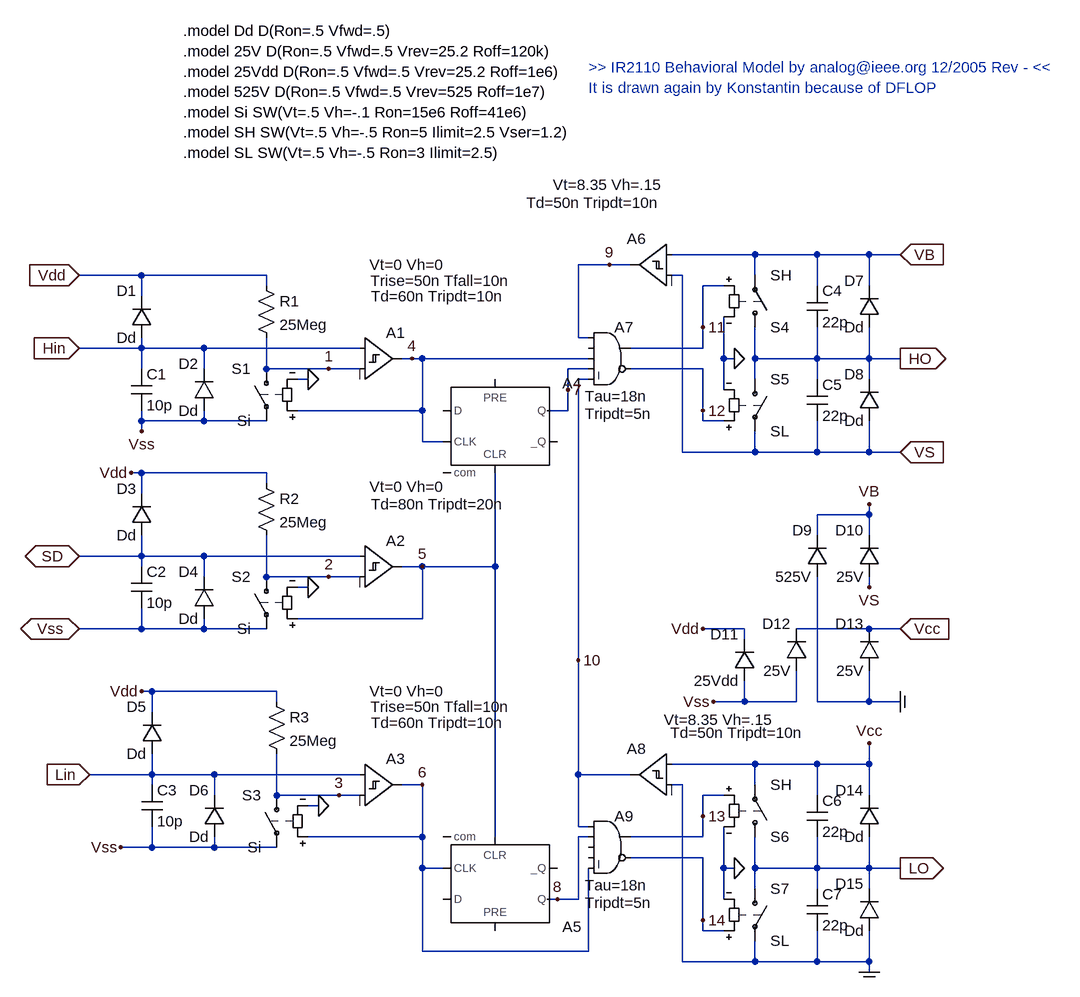
[diagram p0: schematic IR2110A.asc]
IR2110A.asc, the LTspice schematic file:
Version 4
SHEET 1 3528 1264
WIRE 1696 -336 1568 -336
WIRE 1792 -336 1696 -336
WIRE 1872 -336 1792 -336
WIRE 1920 -336 1872 -336
WIRE 1472 -320 1424 -320
WIRE 1504 -320 1472 -320
WIRE 752 -304 656 -304
WIRE 944 -304 752 -304
WIRE 1584 -304 1568 -304
WIRE 1696 -304 1696 -336
WIRE 944 -288 944 -304
WIRE 1648 -288 1616 -288
WIRE 1792 -288 1792 -336
WIRE 1872 -288 1872 -336
WIRE 752 -272 752 -304
WIRE 1616 -224 1616 -288
WIRE 1424 -208 1424 -320
WIRE 1440 -208 1424 -208
WIRE 752 -192 752 -208
WIRE 752 -192 656 -192
WIRE 848 -192 752 -192
WIRE 1088 -192 848 -192
WIRE 1616 -192 1616 -224
WIRE 1616 -192 1504 -192
WIRE 1168 -176 1152 -176
WIRE 1184 -176 1168 -176
WIRE 1440 -176 1184 -176
WIRE 1648 -176 1648 -240
WIRE 1664 -176 1648 -176
WIRE 1696 -176 1696 -224
WIRE 1792 -176 1792 -224
WIRE 1792 -176 1696 -176
WIRE 1872 -176 1872 -224
WIRE 1872 -176 1792 -176
WIRE 1920 -176 1872 -176
WIRE 752 -160 752 -192
WIRE 848 -160 848 -192
WIRE 944 -160 944 -208
WIRE 1040 -160 944 -160
WIRE 1088 -160 1040 -160
WIRE 1440 -160 1408 -160
WIRE 1616 -160 1504 -160
WIRE 1008 -144 992 -144
WIRE 1440 -144 1424 -144
WIRE 1696 -144 1696 -176
WIRE 1792 -144 1792 -176
WIRE 1872 -144 1872 -176
WIRE 1408 -128 1408 -160
WIRE 1648 -128 1648 -176
WIRE 1184 -96 1184 -176
WIRE 1184 -96 992 -96
WIRE 1408 -96 1408 -128
WIRE 1408 -96 1376 -96
WIRE 1616 -96 1616 -160
WIRE 752 -80 752 -96
WIRE 848 -80 848 -96
WIRE 848 -80 752 -80
WIRE 944 -80 848 -80
WIRE 1616 -80 1616 -96
WIRE 1648 -80 1616 -80
WIRE 752 -64 752 -80
WIRE 1184 -48 1184 -96
WIRE 1216 -48 1184 -48
WIRE 1584 -32 1584 -304
WIRE 1696 -32 1696 -64
WIRE 1696 -32 1584 -32
WIRE 1792 -32 1792 -80
WIRE 1792 -32 1696 -32
WIRE 1872 -32 1872 -80
WIRE 1872 -32 1792 -32
WIRE 1920 -32 1872 -32
WIRE 752 0 736 0
WIRE 944 0 752 0
WIRE 944 16 944 0
WIRE 752 32 752 0
WIRE 1872 64 1872 48
WIRE 1872 64 1792 64
WIRE 1792 96 1792 64
WIRE 1872 96 1872 64
WIRE 752 128 752 96
WIRE 752 128 656 128
WIRE 848 128 752 128
WIRE 1088 128 848 128
WIRE 752 144 752 128
WIRE 1184 144 1152 144
WIRE 1296 144 1296 0
WIRE 1296 144 1184 144
WIRE 848 160 848 128
WIRE 944 160 944 96
WIRE 1040 160 944 160
WIRE 1088 160 1040 160
WIRE 1008 176 992 176
WIRE 1872 176 1872 160
WIRE 1184 224 1184 144
WIRE 1184 224 992 224
WIRE 752 240 752 208
WIRE 752 240 656 240
WIRE 848 240 848 224
WIRE 848 240 752 240
WIRE 944 240 848 240
WIRE 1680 240 1616 240
WIRE 1872 240 1760 240
WIRE 1920 240 1872 240
WIRE 1680 256 1680 240
WIRE 1424 288 1424 -144
WIRE 768 336 752 336
WIRE 960 336 768 336
WIRE 960 352 960 336
WIRE 1680 352 1680 320
WIRE 1680 352 1632 352
WIRE 1760 352 1760 304
WIRE 1760 352 1680 352
WIRE 1792 352 1792 160
WIRE 1872 352 1872 304
WIRE 1872 352 1792 352
WIRE 1920 352 1872 352
WIRE 768 368 768 336
WIRE 1696 448 1568 448
WIRE 1792 448 1696 448
WIRE 1872 448 1872 416
WIRE 1872 448 1792 448
WIRE 768 464 768 432
WIRE 768 464 672 464
WIRE 864 464 768 464
WIRE 1088 464 864 464
WIRE 1424 464 1424 288
WIRE 1504 464 1424 464
WIRE 768 480 768 464
WIRE 1184 480 1152 480
WIRE 1584 480 1568 480
WIRE 1696 480 1696 448
WIRE 864 496 864 464
WIRE 960 496 960 432
WIRE 1056 496 960 496
WIRE 1088 496 1056 496
WIRE 1648 496 1616 496
WIRE 1792 496 1792 448
WIRE 1872 496 1872 448
WIRE 1024 512 1008 512
WIRE 1616 528 1616 496
WIRE 1424 544 1424 464
WIRE 1440 544 1424 544
WIRE 1184 560 1184 480
WIRE 1184 560 1008 560
WIRE 1296 560 1296 144
WIRE 1440 560 1424 560
WIRE 1616 560 1616 528
WIRE 1616 560 1504 560
WIRE 768 576 768 544
WIRE 768 576 720 576
WIRE 864 576 864 560
WIRE 864 576 768 576
WIRE 960 576 864 576
WIRE 1616 592 1504 592
WIRE 1184 608 1184 560
WIRE 1216 608 1184 608
WIRE 1648 608 1648 544
WIRE 1664 608 1648 608
WIRE 1696 608 1696 560
WIRE 1792 608 1792 560
WIRE 1792 608 1696 608
WIRE 1872 608 1872 560
WIRE 1872 608 1792 608
WIRE 1920 608 1872 608
WIRE 1696 640 1696 608
WIRE 1792 640 1792 608
WIRE 1872 640 1872 608
WIRE 1392 656 1376 656
WIRE 1424 656 1424 560
WIRE 1424 656 1392 656
WIRE 1648 656 1648 608
WIRE 1616 688 1616 592
WIRE 1616 704 1616 688
WIRE 1648 704 1616 704
WIRE 1184 736 1184 608
WIRE 1440 736 1440 608
WIRE 1440 736 1184 736
WIRE 1584 752 1584 480
WIRE 1696 752 1696 720
WIRE 1696 752 1584 752
WIRE 1792 752 1792 704
WIRE 1792 752 1696 752
WIRE 1872 752 1872 704
WIRE 1872 752 1792 752
WIRE 1872 768 1872 752
FLAG 656 -192 Hin
IOPIN 656 -192 In
FLAG 752 -64 Vss
FLAG 656 -304 Vdd
IOPIN 656 -304 In
FLAG 1008 -144 0
FLAG 1040 -160 1
FLAG 1168 -176 4
FLAG 656 128 SD
IOPIN 656 128 BiDir
FLAG 656 240 Vss
IOPIN 656 240 BiDir
FLAG 736 0 Vdd
FLAG 1008 176 0
FLAG 1040 160 2
FLAG 1184 144 5
FLAG 672 464 Lin
IOPIN 672 464 In
FLAG 720 576 Vss
FLAG 752 336 Vdd
FLAG 1024 512 0
FLAG 1056 496 3
FLAG 1184 480 6
FLAG 1408 -128 7
FLAG 1392 656 8
FLAG 1472 -320 9
FLAG 1920 -336 VB
IOPIN 1920 -336 In
FLAG 1920 -32 VS
IOPIN 1920 -32 In
FLAG 1616 -224 11
FLAG 1616 -96 12
FLAG 1424 288 10
FLAG 1664 -176 0
FLAG 1920 -176 HO
IOPIN 1920 -176 Out
FLAG 1872 48 VB
FLAG 1872 176 VS
FLAG 1920 352 COM
IOPIN 1920 352 BiDir
FLAG 1920 240 Vcc
IOPIN 1920 240 In
FLAG 1616 240 Vdd
FLAG 1632 352 Vss
FLAG 1872 416 Vcc
FLAG 1872 768 COM
FLAG 1616 528 13
FLAG 1616 688 14
FLAG 1664 608 0
FLAG 1920 608 LO
IOPIN 1920 608 Out
SYMBOL cap 736 -160 R0
SYMATTR InstName C1
SYMATTR Value 10p
SYMATTR SpiceLine Rpar=750k
SYMBOL diode 768 -208 R180
WINDOW 0 24 72 Left 0
WINDOW 3 24 0 Left 0
SYMATTR InstName D1
SYMATTR Value Dd
SYMBOL diode 864 -96 R180
WINDOW 0 24 72 Left 0
WINDOW 3 24 0 Left 0
SYMATTR InstName D2
SYMATTR Value Dd
SYMBOL res 928 -304 R0
SYMATTR InstName R1
SYMATTR Value 25Meg
SYMBOL sw 944 -176 M0
SYMATTR InstName S1
SYMATTR Value Si
SYMBOL Digital\\diffschmtbuf 1088 -240 R0
WINDOW 3 15 -80 Left 0
WINDOW 123 16 -56 Left 0
WINDOW 39 17 -32 Left 0
SYMATTR Value Vt=0 Vh=0
SYMATTR Value2 Trise=50n Tfall=10n
SYMATTR SpiceLine Td=60n Tripdt=10n
SYMATTR InstName A1
SYMBOL cap 736 144 R0
SYMATTR InstName C2
SYMATTR Value 10p
SYMATTR SpiceLine Rpar=750k
SYMBOL diode 768 96 R180
WINDOW 0 24 72 Left 0
WINDOW 3 24 0 Left 0
SYMATTR InstName D3
SYMATTR Value Dd
SYMBOL diode 864 224 R180
WINDOW 0 24 72 Left 0
WINDOW 3 24 0 Left 0
SYMATTR InstName D4
SYMATTR Value Dd
SYMBOL res 928 0 R0
SYMATTR InstName R2
SYMATTR Value 25Meg
SYMBOL sw 944 144 M0
SYMATTR InstName S2
SYMATTR Value Si
SYMBOL Digital\\diffschmtbuf 1088 80 R0
WINDOW 3 15 -59 Left 0
WINDOW 123 16 -56 Left 0
WINDOW 39 17 -32 Left 0
SYMATTR Value Vt=0 Vh=0
SYMATTR SpiceLine Td=80n Tripdt=20n
SYMATTR InstName A2
SYMBOL cap 752 480 R0
SYMATTR InstName C3
SYMATTR Value 10p
SYMATTR SpiceLine Rpar=750k
SYMBOL diode 784 432 R180
WINDOW 0 24 72 Left 0
WINDOW 3 24 0 Left 0
SYMATTR InstName D5
SYMATTR Value Dd
SYMBOL diode 880 560 R180
WINDOW 0 24 72 Left 0
WINDOW 3 24 0 Left 0
SYMATTR InstName D6
SYMATTR Value Dd
SYMBOL res 944 336 R0
SYMATTR InstName R3
SYMATTR Value 25Meg
SYMBOL sw 960 480 M0
SYMATTR InstName S3
SYMATTR Value Si
SYMBOL Digital\\diffschmtbuf 1088 416 R0
WINDOW 3 15 -80 Left 0
WINDOW 123 16 -56 Left 0
WINDOW 39 17 -32 Left 0
SYMATTR Value Vt=0 Vh=0
SYMATTR Value2 Trise=50n Tfall=10n
SYMATTR SpiceLine Td=60n Tripdt=10n
SYMATTR InstName A3
SYMBOL Digital\\dflop 1296 -144 R0
SYMATTR InstName A4
SYMBOL Digital\\dflop 1296 704 M180
SYMATTR InstName A5
SYMBOL Digital\\diffschmtbuf 1568 -384 M0
WINDOW 3 15 -59 Left 0
WINDOW 123 16 -56 Left 0
WINDOW 39 17 -32 Left 0
SYMATTR Value Vt=8.35 Vh=.15
SYMATTR SpiceLine Td=50n Tripdt=10n
SYMATTR InstName A6
SYMBOL Digital\\and 1472 -240 R0
WINDOW 3 -38 122 Left 0
WINDOW 123 -38 149 Left 0
SYMATTR Value Tau=18n
SYMATTR Value2 Tripdt=5n
SYMATTR InstName A7
SYMBOL sw 1696 -208 M180
SYMATTR InstName S4
SYMATTR Value SH
SYMBOL sw 1696 -160 R0
SYMATTR InstName S5
SYMATTR Value SL
SYMBOL cap 1776 -288 R0
SYMATTR InstName C4
SYMATTR Value 22p
SYMBOL cap 1776 -144 R0
SYMATTR InstName C5
SYMATTR Value 22p
SYMATTR SpiceLine Rpar=100k
SYMBOL diode 1888 -224 R180
WINDOW 0 24 72 Left 0
WINDOW 3 24 0 Left 0
SYMATTR InstName D7
SYMATTR Value Dd
SYMBOL diode 1888 -80 R180
WINDOW 0 24 72 Left 0
WINDOW 3 24 0 Left 0
SYMATTR InstName D8
SYMATTR Value Dd
SYMBOL diode 1808 160 R180
WINDOW 0 24 72 Left 0
WINDOW 3 24 0 Left 0
SYMATTR InstName D9
SYMATTR Value 525V
SYMBOL diode 1888 160 R180
WINDOW 0 24 72 Left 0
WINDOW 3 24 0 Left 0
SYMATTR InstName D10
SYMATTR Value 25V
SYMBOL diode 1696 320 R180
WINDOW 0 24 72 Left 0
WINDOW 3 24 0 Left 0
SYMATTR InstName D11
SYMATTR Value 25Vdd
SYMBOL diode 1776 304 R180
WINDOW 0 24 72 Left 0
WINDOW 3 24 0 Left 0
SYMATTR InstName D12
SYMATTR Value 25V
SYMBOL diode 1888 304 R180
WINDOW 0 24 72 Left 0
WINDOW 3 24 0 Left 0
SYMATTR InstName D13
SYMATTR Value 25V
SYMBOL Digital\\diffschmtbuf 1568 400 M0
WINDOW 3 -156 -20 Left 0
WINDOW 123 16 -56 Left 0
WINDOW 39 -205 0 Left 0
SYMATTR Value Vt=8.35 Vh=.15
SYMATTR SpiceLine Td=50n Tripdt=10n
SYMATTR InstName A8
SYMBOL Digital\\and 1472 512 R0
WINDOW 3 -38 122 Left 0
WINDOW 123 -38 149 Left 0
SYMATTR Value Tau=18n
SYMATTR Value2 Tripdt=5n
SYMATTR InstName A9
SYMBOL sw 1696 576 M180
SYMATTR InstName S6
SYMATTR Value SH
SYMBOL sw 1696 624 R0
SYMATTR InstName S7
SYMATTR Value SL
SYMBOL cap 1776 496 R0
SYMATTR InstName C6
SYMATTR Value 22p
SYMBOL cap 1776 640 R0
SYMATTR InstName C7
SYMATTR Value 22p
SYMATTR SpiceLine Rpar=100k
SYMBOL diode 1888 560 R180
WINDOW 0 24 72 Left 0
WINDOW 3 24 0 Left 0
SYMATTR InstName D14
SYMATTR Value Dd
SYMBOL diode 1888 704 R180
WINDOW 0 24 72 Left 0
WINDOW 3 24 0 Left 0
SYMATTR InstName D15
SYMATTR Value Dd
TEXT 816 -680 Left 0 !.model Dd D(Ron=.5 Vfwd=.5)\n.model 25V D(Ron=.5 Vfwd=.5 Vrev=25.2 Roff=120k)\n.model 25Vdd D(Ron=.5 Vfwd=.5 Vrev=25.2 Roff=1e6)\n.model 525V D(Ron=.5 Vfwd=.5 Vrev=525 Roff=1e7)\n.model Si SW(Vt=.5 Vh=-.1 Ron=15e6 Roff=41e6)\n.model SH SW(Vt=.5 Vh=-.5 Ron=5 Ilimit=2.5 Vser=1.2)\n.model SL SW(Vt=.5 Vh=-.5 Ron=3 Ilimit=2.5)
TEXT 1440 -624 Left 0 ;>> IR2110 Behavioral Model by analog@ieee.org 12/2005 Rev - <<\nIt is drawn again by Konstantin because of DFLOP

The netlist it stands for:
* IR2110A.asc
C1 Hin Vss 10p Rpar=750k
D1 Hin Vdd Dd
D2 Vss Hin Dd
R1 Vdd 1 25Meg
S1 1 Vss 4 0 Si
A1 Hin 1 0 0 0 0 4 0 SCHMITT Vt=0 Vh=0 Trise=50n Tfall=10n Td=60n Tripdt=10n
C2 SD Vss 10p Rpar=750k
D3 SD Vdd Dd
D4 Vss SD Dd
R2 Vdd 2 25Meg
S2 2 Vss 5 0 Si
A2 SD 2 0 0 0 0 5 0 SCHMITT Vt=0 Vh=0 Td=80n Tripdt=20n
C3 Lin Vss 10p Rpar=750k
D5 Lin Vdd Dd
D6 Vss Lin Dd
R3 Vdd 3 25Meg
S3 3 Vss 6 0 Si
A3 Lin 3 0 0 0 0 6 0 SCHMITT Vt=0 Vh=0 Trise=50n Tfall=10n Td=60n Tripdt=10n
A4 0 0 4 0 5 0 7 0 DFLOP
A5 0 0 6 0 5 0 8 0 DFLOP
A6 VB VS 0 0 0 0 9 0 SCHMITT Vt=8.35 Vh=.15 Td=50n Tripdt=10n
A7 9 0 4 7 10 12 11 0 AND Tau=18n Tripdt=5n
S4 HO VB 11 0 SH
S5 HO VS 12 0 SL
C4 VB HO 22p
C5 HO VS 22p Rpar=100k
D7 HO VB Dd
D8 VS HO Dd
D9 COM VB 525V
D10 VS VB 25V
D11 Vss Vdd 25Vdd
D12 Vss Vcc 25V
D13 COM Vcc 25V
A8 Vcc COM 0 0 0 0 10 0 SCHMITT Vt=8.35 Vh=.15 Td=50n Tripdt=10n
A9 10 8 0 0 6 14 13 0 AND Tau=18n Tripdt=5n
S6 LO Vcc 13 0 SH
S7 LO COM 14 0 SL
C6 Vcc LO 22p
C7 LO COM 22p Rpar=100k
D14 LO Vcc Dd
D15 COM LO Dd
.model D D
.lib standard.dio
.model Dd D(Ron=.5 Vfwd=.5)
.model 25V D(Ron=.5 Vfwd=.5 Vrev=25.2 Roff=120k)
.model 25Vdd D(Ron=.5 Vfwd=.5 Vrev=25.2 Roff=1e6)
.model 525V D(Ron=.5 Vfwd=.5 Vrev=525 Roff=1e7)
.model Si SW(Vt=.5 Vh=-.1 Ron=15e6 Roff=41e6)
.model SH SW(Vt=.5 Vh=-.5 Ron=5 Ilimit=2.5 Vser=1.2)
.model SL SW(Vt=.5 Vh=-.5 Ron=3 Ilimit=2.5)
* >> IR2110 Behavioral Model by analog@ieee.org 12/2005 Rev - <<
* It is drawn again by Konstantin because of DFLOP
.backanno
.end